# EAGLE schematic brd esp32 (EAGLE 9.4.2)
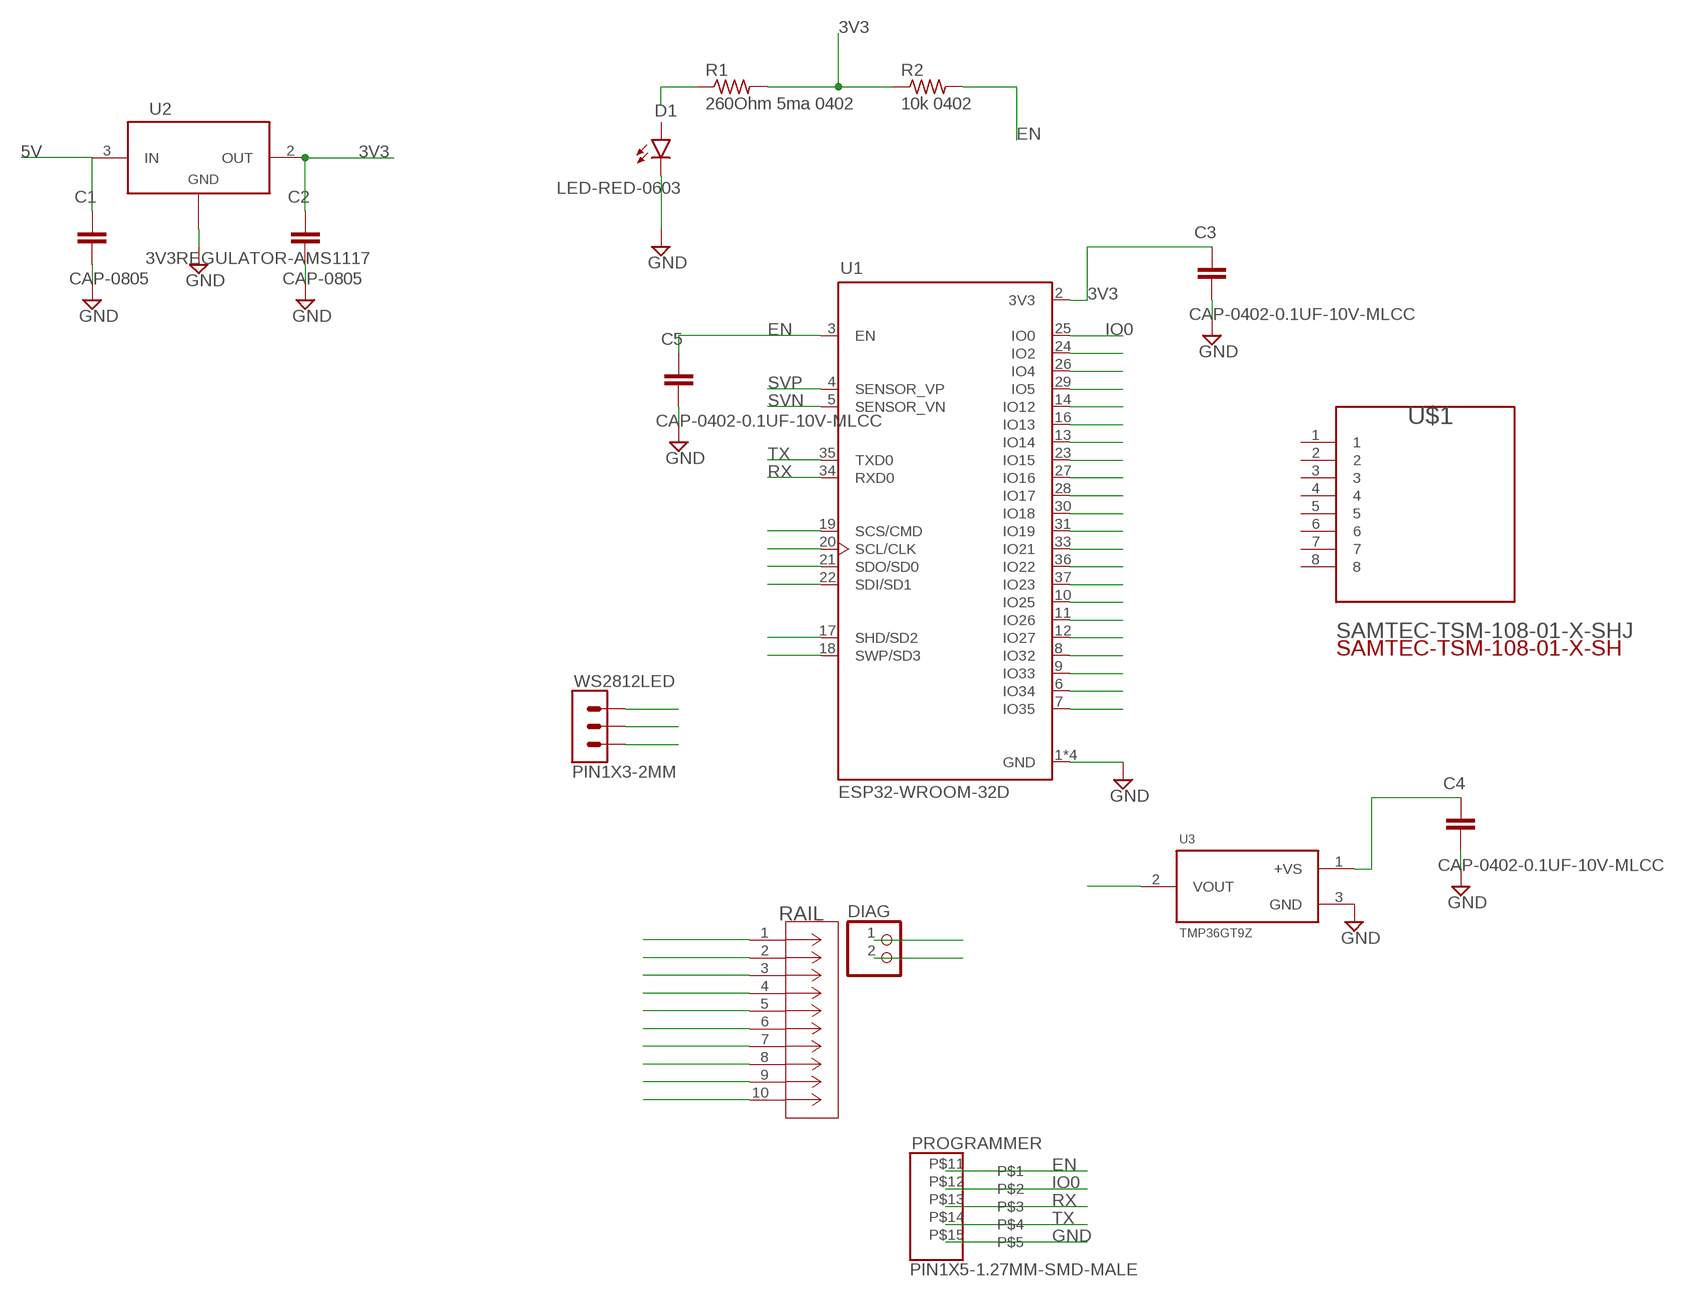
[diagram p0: schematic, sheet 1]

## Parts
C1  CAP-0805  [CAP_0805]
C2  CAP-0805  [CAP_0805]
C3  CAP-0402-0.1UF-10V-MLCC  [CAP_0402]
C4  CAP-0402-0.1UF-10V-MLCC  [CAP_0402]
C5  CAP-0402-0.1UF-10V-MLCC  [CAP_0402]
D1  LED-RED-0603  [LED-0603]
DIAG  PINHD-1X2  [1X02]
PROGRAMMER  PIN1X5-1.27MM-SMD-MALE  [PIN1X5-1.27MM-SMD]
R1  260Ohm 5ma 0402  RES-0402  [RES_0402]
R2  10k 0402  RES-0402  [RES_0402]
RAIL  SSW-105-01-G-D  [CON10_2X5_TU_SSQ]
U1  ESP32-WROOM-32D  [MODULE_ESP32-WROOM-32D]
U2  3V3REGULATOR-AMS1117  [SOT-223]
U3  TMP36GT9Z  [TO127P419X483X533-3P]
U$1  SAMTEC-TSM-108-01-X-SHJ  [SAMTEC-TSM-108-01-X-SH]
WS2812LED  PIN1X3-2MM  [PIN1X3-2MM]

## Nets
3V3: C2.1 C3.1 R1.2 R2.1 U1.2(3V3) U2.2(OUT) U2.4
5V: C1.1 U2.3(IN)
EN: C5.1 PROGRAMMER.P$11 R2.2 U1.3(EN)
GND: C1.2 C2.2 C3.2 C4.2 C5.2 D1.C PROGRAMMER.P$15 U1.1(GND) U1.15(GND) U1.38(GND) U1.39(GND) U2.1(ADJ/GND) U3.3(GND)
IO0: PROGRAMMER.P$12 U1.25(IO0)
N$1: R1.1
N$2: RAIL.1
N$3: U1.24(IO2)
N$4: U1.26(IO4)
N$5: U1.29(IO5)
N$6: U1.19(SCS/CMD)
N$7: U1.20(SCL/CLK)
N$8: U1.21(SDO/SD0)
N$9: U1.22(SDI/SD1)
N$10: U1.17(SHD/SD2)
N$11: U1.18(SWP/SD3)
N$12: U1.14(IO12)
N$13: U1.16(IO13)
N$14: U1.13(IO14)
N$15: U1.23(IO15)
N$16: U1.27(IO16)
N$17: U1.28(IO17)
N$18: U1.30(IO18)
N$19: U1.31(IO19)
N$20: U1.33(IO21)
N$21: U1.36(IO22)
N$22: U1.37(IO23)
N$23: U1.10(IO25)
N$24: U1.11(IO26)
N$25: U1.12(IO27)
N$26: U1.8(IO32)
N$27: U1.9(IO33)
N$28: U1.6(IO34)
N$29: U1.7(IO35)
N$30: C4.1 U3.1(+VS)
N$31: U3.2(VOUT)
N$32: WS2812LED.1
N$33: WS2812LED.2
N$34: WS2812LED.3
N$35: RAIL.2
N$36: RAIL.3
N$37: RAIL.4
N$38: RAIL.5
N$39: RAIL.6
N$40: RAIL.7
N$41: RAIL.8
N$42: RAIL.9
N$43: RAIL.10
N$44: DIAG.1
N$45: DIAG.2
RX: PROGRAMMER.P$13 U1.34(RXD0)
SVN: U1.5(SENSOR_VN)
SVP: U1.4(SENSOR_VP)
TX: PROGRAMMER.P$14 U1.35(TXD0)
Unconnected: D1.A U$1.1 U$1.2 U$1.3 U$1.4 U$1.5 U$1.6 U$1.7 U$1.8

## Library data of the parts
C1 C2 = robot actuator:CAP-0805: CAP CER 0.1UF 50V X7R 0805 Manufacturer's datasheet <http://www.yageo.com/documents/recent/UPY-GPHC_X7R_6.3V-to-50V_18.pdf>; CREATED_BY: PCBLayout.com; DIGIKEY_PART_NUMBER: 311-1140-2-ND; MANUFACTURER: Yageo; MPN: CC0805KRX7R9BB104; PACKAGE: SMD 0805
C3-C5 = robot actuator:CAP-0402-0.1UF-10V-MLCC: CAP MLCC 0.1uf 10V 0402 LCSC.com <https://lcsc.com/product-detail/Others_Vishay-Intertech_VJ0402G104KXQCW1BC_Vishay-Intertech-VJ0402G104KXQCW1BC_C169292.html>; CREATED_BY: ChiliPeppr; DIGIKEY_PART_NUMBER: VJ0402G104KXQCW1BC; MANUFACTURER: Vishay Intertech; MPN: VJ0402G104KXQCW1BC; PACKAGE: SMD 0402
D1 = robot actuator:LED-RED-0603: Light Emitting Diodes (LED) Red 615~630nm 80~100mcd@20mA Top View 0603 RoHS LCSC Link <https://lcsc.com/product-detail/Light-Emitting-Diodes-LED_Red-LED-SMDLED-80-100mcd_C84263.html>; CREATED_BY: ChiliPeppr; DIGIKEY_PART_NUMBER: FC-DA1608HRK-620D; MANUFACTURER: Foshan NationStar Optoelectronics; MPN: FC-DA1608HRK-620D; PACKAGE: 0603
DIAG = robot actuator:PINHD-1X2: PIN HEADER
PROGRAMMER = robot actuator:PIN1X5-1.27MM-SMD-MALE: Aliexpress <https://www.aliexpress.com/item/5pcs-1x40P-1-27mm-SMD-Pin-Header-0-05-SMT-Male-Pin-Surface-Mount-Type-Single/32891063757.html> 5pcs 1x40P 1.27mm SMD Pin Header,0.05" SMT Male Pin,Surface Mount Type, Single Row Golden-Plated Rohs
R1 R2 = robot actuator:RES-0402: RES SMD 0402; CREATED_BY: ChiliPeppr; PACKAGE: SMD 0402
RAIL = robot actuator:SSW-105-01-G-D; MANUFACTURER_PART_NUMBER: SSW10501GD; VENDOR: Samtec Inc
U1 = robot actuator:ESP32-WROOM-32D: IC: SoC; GPIO, I2C, I2S, IR, SD, SDIO, SPI, UART; 2.7÷3.6VDC; 20dBm; DESCRIPTION: IC: SoC; GPIO, I2C, I2S, IR, SD, SDIO, SPI, UART; 2.7÷3.6VDC; 20dBm; DIGI-KEY_PART_NUMBER: 1904-1023-1-ND; DIGI-KEY_PURCHASE_URL: https://www.digikey.es/product-detail/en/espressif-systems/ESP32-WROOM-32D/1904-1023-1-ND/9381732?utm_source=snapeda&utm_medium=aggregator&utm_campaign=symbol; MF: Espressif Systems; MP: ESP32-WROOM-32D; PACKAGE: Module Espressif Systems
U2 = robot actuator:3V3REGULATOR-AMS1117: IC REG LINEAR 3.3V 1A SOT223 Manufacturer's datasheet <https://www.onsemi.com/pub/Collateral/NCP1117-D.PDF>; CREATED_BY: PCBLayout.com; DIGIKEY_PART_NUMBER: NCP1117ST33T3GOSTR-ND; MANUFACTURER: ON Semiconductor; MPN: NCP1117ST33T3G; PACKAGE: SOT-223
U3 = robot actuator:TMP36GT9Z: Low Voltage Temperature Sensors; AVAILABILITY: Unavailable; DESCRIPTION: Temp Sensor Analog_Voltage_ Serial _2-Wire_ 3-Pin TO-92 Tray; MF: Analog Devices; MP: TMP36GT9Z; PACKAGE: TO-92 Analog Devices; PRICE: None
U$1 = robot actuator:SAMTEC-TSM-108-01-X-SH; DESCRIPTION: Conn Unshrouded Header HDR 8 POS 2.54mm Solder RA SMD Automotive Tube; DIGI-KEY_PART_NUMBER: SAM10294-ND; DIGI-KEY_PURCHASE_URL: https://www.digikey.es/product-detail/en/samtec-inc/TSM-108-01-L-SH/SAM10294-ND/6679031?utm_source=snapeda&utm_medium=aggregator&utm_campaign=symbol; MF: Samtec Inc.; MP: TSM-108-01-L-SH; PACKAGE: None
WS2812LED = robot actuator:PIN1X3-2MM: THT Vertical Pin Header WR-PHD, Pitch 2.00 mm, Single Row, 3 pins Manufacturer's datasheet <https://datasheet.octopart.com/62000311121-W%C3%BCrth-Elektronik-datasheet-117282002.pdf>; CREATED_BY: PCBLayout.com; MANUFACTURER: Würth Elektronik; MPN: 62000311121